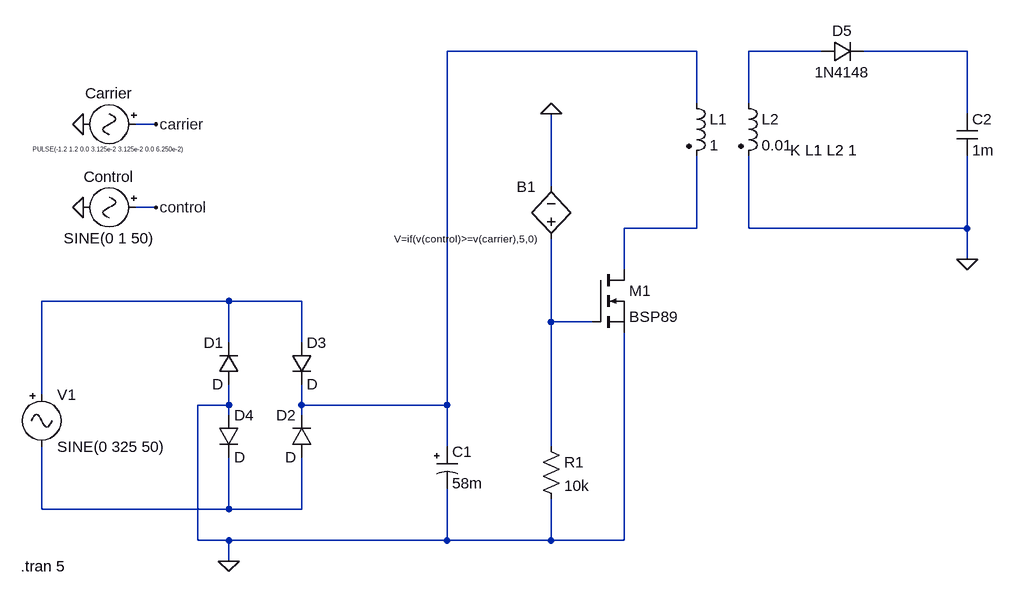
[diagram p0: schematic SMPS_ElectrArc240Basic.asc]
SMPS_ElectrArc240Basic.asc, the LTspice schematic file:
Version 4
SHEET 1 1364 680
WIRE 896 -320 512 -320
WIRE 1088 -320 976 -320
WIRE 1312 -320 1152 -320
WIRE 896 -240 896 -320
WIRE 976 -240 976 -320
WIRE 1312 -224 1312 -320
WIRE 64 -208 32 -208
WIRE 672 -112 672 -224
WIRE 64 -80 32 -80
WIRE 896 -48 896 -160
WIRE 896 -48 784 -48
WIRE 976 -48 976 -160
WIRE 1312 -48 1312 -160
WIRE 1312 -48 976 -48
WIRE 1312 0 1312 -48
WIRE 784 16 784 -48
WIRE 176 64 -112 64
WIRE 288 64 176 64
WIRE 672 96 672 -32
WIRE 736 96 672 96
WIRE 176 128 176 64
WIRE 288 128 288 64
WIRE -112 208 -112 64
WIRE 176 224 176 192
WIRE 176 224 128 224
WIRE 288 224 288 192
WIRE 512 224 512 -320
WIRE 512 224 288 224
WIRE 176 240 176 224
WIRE 288 240 288 224
WIRE 512 288 512 224
WIRE 672 288 672 96
WIRE -112 384 -112 288
WIRE 176 384 176 304
WIRE 176 384 -112 384
WIRE 288 384 288 304
WIRE 288 384 176 384
WIRE 128 432 128 224
WIRE 176 432 128 432
WIRE 512 432 512 352
WIRE 512 432 176 432
WIRE 672 432 672 368
WIRE 672 432 512 432
WIRE 784 432 784 112
WIRE 784 432 672 432
WIRE 176 464 176 432
FLAG 176 464 0
FLAG -48 -208 0
FLAG -48 -80 0
FLAG 64 -208 carrier
FLAG 64 -80 control
FLAG 672 -224 0
FLAG 1312 0 0
SYMBOL signal -112 192 R0
SYMATTR InstName V1
SYMATTR Value SINE(0 325 50)
SYMBOL Diode 192 192 R180
WINDOW 0 24 64 Left 2
WINDOW 3 24 0 Left 2
SYMATTR InstName D1
SYMBOL Diode 304 304 R180
WINDOW 0 24 64 Left 2
WINDOW 3 24 0 Left 2
SYMATTR InstName D2
SYMBOL Diode 272 128 R0
SYMATTR InstName D3
SYMBOL Diode 160 240 R0
SYMATTR InstName D4
SYMBOL polcap 496 288 R0
WINDOW 3 24 56 Left 2
SYMATTR InstName C1
SYMATTR Value 58m
SYMATTR Description Capacitor
SYMATTR Type cap
SYMATTR SpiceLine V=ishay Rser=17m Lser=0 mfg="Vishay" pn="EP2C583M035" type="Tantalum Wet"
SYMBOL nmos 736 16 R0
SYMATTR InstName M1
SYMATTR Value BSP89
SYMBOL ind2 880 -256 R0
SYMATTR InstName L1
SYMATTR Value 1
SYMATTR Type ind
SYMBOL ind2 960 -256 R0
SYMATTR InstName L2
SYMATTR Value 0.01
SYMATTR Type ind
SYMBOL signal 48 -208 R90
WINDOW 0 -32 56 VBottom 2
WINDOW 3 32 56 VTop 0
SYMATTR InstName Carrier
SYMATTR Value PULSE(-1.2 1.2 0.0 3.125e-2 3.125e-2 0.0 6.250e-2)
SYMBOL signal 48 -80 R90
WINDOW 0 -32 56 VBottom 2
WINDOW 3 32 56 VTop 2
SYMATTR InstName Control
SYMATTR Value SINE(0 1 50)
SYMBOL Res 656 272 R0
SYMATTR InstName R1
SYMATTR Value 10k
SYMBOL bv 672 -16 R180
WINDOW 0 24 96 Left 2
WINDOW 3 24 16 Left 1
SYMATTR InstName B1
SYMATTR Value V=if(v(control)>=v(carrier),5,0)
SYMBOL diode 1088 -304 R270
WINDOW 0 32 32 VTop 2
WINDOW 3 0 32 VBottom 2
SYMATTR InstName D5
SYMATTR Value 1N4148
SYMBOL Cap 1296 -224 R0
SYMATTR InstName C2
SYMATTR Value 1m
TEXT -144 472 Left 2 !.tran 5
TEXT 1040 -168 Left 2 !K L1 L2 1

The netlist it stands for:
* SMPS_ElectrArc240Basic.asc
V1 N005 N007 SINE(0 325 50)
D1 0 N005 D
D2 N007 N001 D
D3 N005 N001 D
D4 0 N007 D
C1 N001 0 58m V=ishay Rser=17m Lser=0 mfg="Vishay" pn="EP2C583M035" type="Tantalum Wet"
M1 N004 N006 0 0 BSP89
L1 N001 N004 1
L2 N002 0 0.01
V§Carrier carrier 0 PULSE(-1.2 1.2 0.0 3.125e-2 3.125e-2 0.0 6.250e-2)
V§Control control 0 SINE(0 1 50)
R1 N006 0 10k
B1 N006 0 V=if(v(control)>=v(carrier),5,0)
D5 N002 N003 1N4148
C2 N003 0 1m
.model D D
.lib standard.dio
.model NMOS NMOS
.model PMOS PMOS
.lib standard.mos
.tran 5
K L1 L2 1
.backanno
.end